# EAGLE design HoverPuck (EAGLE 7.2.0)
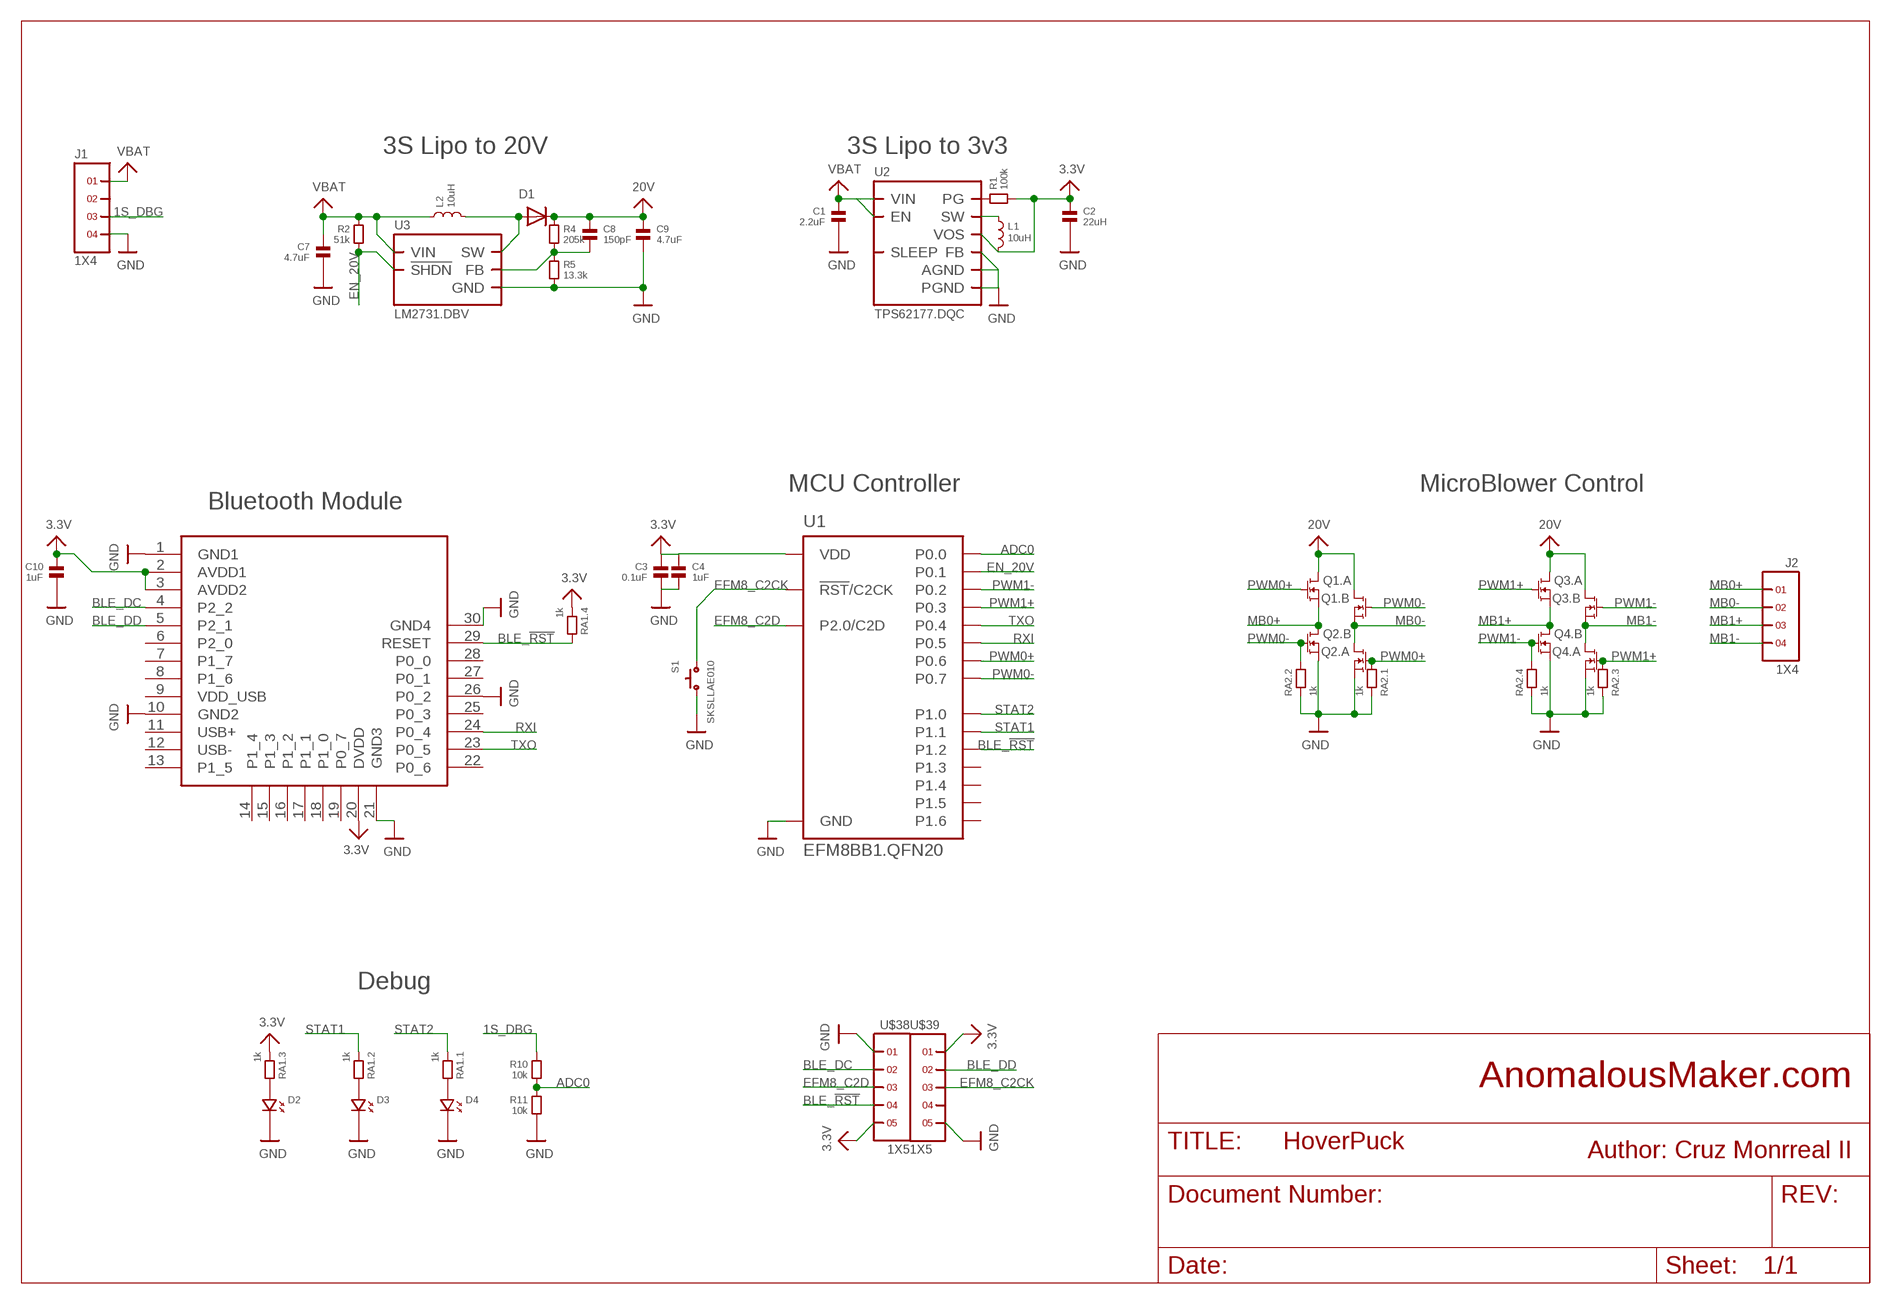
[diagram p0: schematic, sheet 1]

## Parts
C1  2.2uF  CAPACITOR.0603  [0603]
C2  22uH  CAPACITOR.0805  [0805]
C3  0.1uF  CAPACITOR.0603  [0603]
C4  1uF  CAPACITOR.0603  [0603]
C7  4.7uF  CAPACITOR.0805  [0805]
C8  150pF  CAPACITOR.0603  [0603]
C9  4.7uF  CAPACITOR.0805  [0805]
C10  1uF  CAPACITOR.0603  [0603]
D1  MBR0530T1G  DIODESOD-123  [SOD-123]
D2  LED.0603  [0603.LED]
D3  LED.0603  [0603.LED]
D4  LED.0603  [0603.LED]
J1  1X4  [1X4]
J2  1X4  [1X4]
L1  10uH  INDUCTOR.LPS4018  [LPS4018]
L2  10uH  INDUCTOR-SRN6045  [SRN6045]
Q1  FDMA  [MICROFET.2X2]
Q2  FDMA  [MICROFET.2X2]
Q3  FDMA  [MICROFET.2X2]
Q4  FDMA  [MICROFET.2X2]
R1  100k  RESISTOR.0603  [0603]
R2  51k  RESISTOR.0603  [0603]
R4  205k  RESISTOR.0603  [0603]
R5  13.3k  RESISTOR.0603  [0603]
R10  10k  RESISTOR.0603  [0603]
R11  10k  RESISTOR.0603  [0603]
RA1  1k  RA-4.0603  [0603.4.C]
RA2  1k  RA-4.0603  [0603.4.C]
S1  SKSLLAE010  [SKSLLAE010]
U1  EFM8BB1.QFN20  [QFN20]
U2  TPS62177.DQC  [DQC]
U3  LM2731.DBV  [DBV.5]
U4  BLE112-A  [BLE112-A]
U$38  1X5  [1X5]
U$39  1X5  [1X5]

## Nets
1S_DBG: J1.3 R10.1
3.3V: C2.1 C3.1 C4.1 C10.1 L1.2 R1.2 RA1.5 RA1.7 U1.4(VDD) U2.10(VOS) U4.2(AVDD1) U4.3(AVDD2) U4.20(DVDD) U$38.5 U$39.1
20V: C8.1 C9.1 D1.C Q1.3(.B:D) Q1.6(.A:D) Q1.PAD@1(.A:D) Q1.PAD@2(.B:D) Q3.3(.B:D) Q3.6(.A:D) Q3.PAD@1(.A:D) Q3.PAD@2(.B:D) R4.1
ADC0: R10.2 R11.1 U1.2(P0.0)
BLE_!RST: RA1.8 U1.11(P1.2) U4.29(RESET) U$38.4
BLE_DC: U4.4(P2_2) U$38.2
BLE_DD: U4.5(P2_1) U$39.2
EFM8_C2CK: S1.1 U1.5(!RST!/C2CK) U$39.3
EFM8_C2D: U1.6(P2.0/C2D) U$38.3
EN_20V: R2.2 U1.1(P0.1) U3.4(!SHDN)
GND: C1.2 C2.2 C3.2 C4.2 C7.2 C9.2 C10.2 D2.P$2 D3.P$2 D4.P$2 J1.4 Q2.1(.A:S) Q2.4(.B:S) Q4.1(.A:S) Q4.4(.B:S) R5.2 R11.2 RA2.1 RA2.3 RA2.5 RA2.7 S1.2 U1.3(GND) U1.12(GND) U1.PAD(GND) U2.1(PGND) U2.5(FB) U2.6(AGND) U2.PAD(PGND) U3.2(GND) U4.1(GND1) U4.10(GND2) U4.21(GND3) U4.26(P0_2) U4.30(GND4) U$38.1 U$39.5
MB0+: J2.1 Q1.1(.A:S) Q2.3(.B:D) Q2.PAD@2(.B:D)
MB0-: J2.2 Q1.4(.B:S) Q2.6(.A:D) Q2.PAD@1(.A:D)
MB1+: J2.3 Q3.1(.A:S) Q4.3(.B:D) Q4.PAD@2(.B:D)
MB1-: J2.4 Q3.4(.B:S) Q4.6(.A:D) Q4.PAD@1(.A:D)
N$3: L1.1 U2.9(SW)
N$4: D2.P$1 RA1.6
N$5: D1.A L2.2 U3.1(SW)
N$6: R1.1 U2.7(PG)
N$7: C8.2 R4.2 R5.1 U3.3(FB)
N$8: D3.P$1 RA1.4
N$9: D4.P$1 RA1.2
PWM0+: Q1.2(.A:G) Q2.2(.A:G) RA2.2 U1.16(P0.6)
PWM0-: Q1.5(.B:G) Q2.5(.B:G) RA2.4 U1.15(P0.7)
PWM1+: Q3.2(.A:G) Q4.2(.A:G) RA2.6 U1.19(P0.3)
PWM1-: Q3.5(.B:G) Q4.5(.B:G) RA2.8 U1.20(P0.2)
RXI: U1.17(P0.5) U4.24(P0_4)
STAT1: RA1.3 U1.13(P1.1)
STAT2: RA1.1 U1.14(P1.0)
TXO: U1.18(P0.4) U4.23(P0_5)
VBAT: C1.1 C7.1 J1.1 L2.1 R2.1 U2.2(VIN) U2.3(EN) U3.5(VIN)
Unconnected: J1.2 U1.7(P1.6) U1.8(P1.5) U1.9(P1.4) U1.10(P1.3) U2.8(SLEEP) U4.6(P2_0) U4.7(P1_7) U4.8(P1_6) U4.9(VDD_USB) U4.11(USB+) U4.12(USB-) U4.13(P1_5) U4.14(P1_4) U4.15(P1_3) U4.16(P1_2) U4.17(P1_1) U4.18(P1_0) U4.19(P0_7) U4.22(P0_6) U4.25(P0_3) U4.27(P0_1) U4.28(P0_0) U$39.4

## Notes on the sheet
- 3S Lipo to 20V | 3S Lipo to 3v3
- MCU Controller | MicroBlower Control
- Bluetooth Module
- Debug
- AnomalousMaker.com
- Author: Cruz Monrreal II

## Library data of the parts
C1-C4 C7-C10 = standardparts:CAPACITOR
D1 = microbuilder:DIODE: Diode SMA Model Volts Amps Type Vf Vr Digikey # Notes SSA34-E3 40V 3A Schottky 480mV @ 3A 200uA @ 40V SSA34-E3/61TGITR-ND CDBA120-G 20V 1A Schottky 500mV @ 1A 500uA @ 20V 641-1014-6-ND REEL MBRA210 10V 2A Schottky 350mV @ 2A 700uA @ 10V MBRA210LT3 SOD-123 Model Volts Amps Type Vf Vr Order # Notes BAT54T1G 30V 200mA Schottky 800mV @ 200mA 2uA @ 25V BAT54T1GOSTR-ND B0530W 30V 500mA Schottky 430mV @ 500mA 130uA @ 30V B0530W-FDICT-ND REEL MBR120 1A 20V Schottky 340mV @ 1A MBR120VLSFT1GOSCT-ND SOD-323 Model Volts Amps Type Vf Vr Order # Notes PMEG2005EJ 20V 500mA Schottky 355mV @ 500mA 568-4110-1-ND ZLLS410 10V 570mA Schottky 380mV @ 570mA ZLLS410CT-ND 1N4148WS 75V 150mA Silicon/Simple 1V 1N4148WSFSCT-ND REEL SOD-523 Model Volts Amps Type Vf Vr Order # Notes BAT54XV2 30V 200mA Schottky 0.8V @ 100mA BAT54XV2CT-ND TB751S 30V 30mA Schottky RB751S-40TE61CT-ND SOT23-R/W (R = Solder Paste/Reflow Ovens, W = Hand-Soldering) Model Volts Amps Type Vf Vr Order # Notes BAT54FILM 40V 300mA Schottky 497-7162-1-ND
D2-D4 = standardparts:LED
J1 J2 = headers(2mm):1X4
L1 = coilcraft:INDUCTOR
L2 = bourns:INDUCTOR
Q1-Q4 = fairchild:FDMA
R1 R2 R4 R5 R10 R11 = standardparts:RESISTOR
RA1 RA2 = resistorarray:RA-4: Dimentions sources from here: http://www.ctscorp.com/components/Datasheets/CTSChipArrayDs.pdf
S1 = alps:SKSLLAE010
U1 = silabs:EFM8BB1
U2 = packages(ti):TPS62177
U3 = packages(ti):LM2731
U4 = SparkFun-RF:BLE112-A: BlueGiga Bluetooth 4.0 module with integrated chip antenna and onboard 8051 processor and peripherals
U$38 U$39 = headers(.05in):1X5

## Board
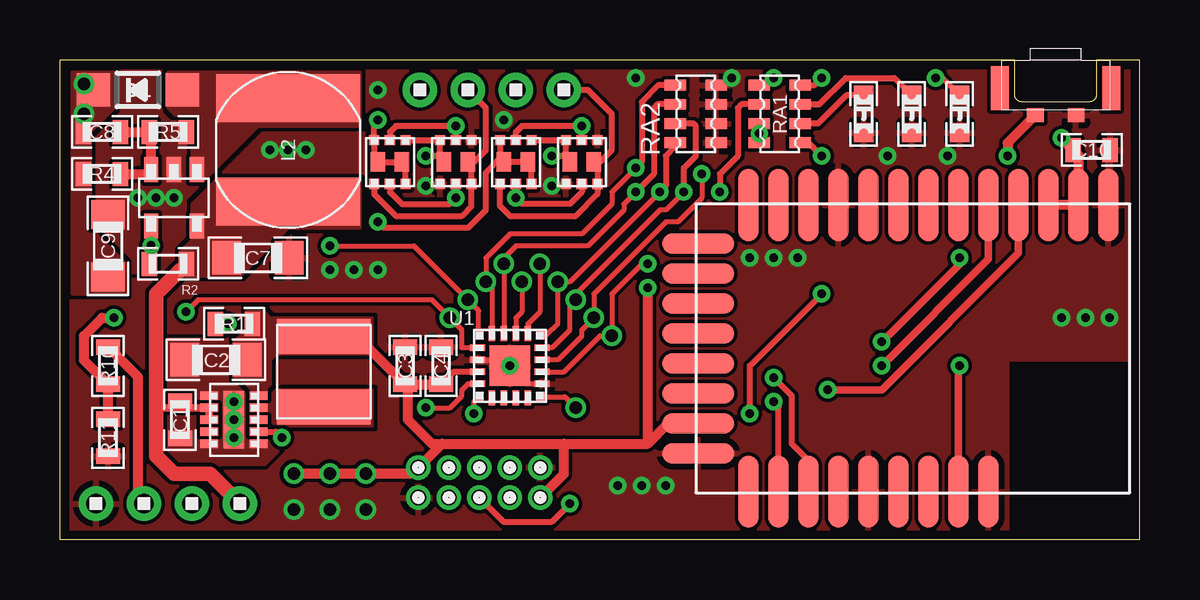
[diagram p1: board, top side]
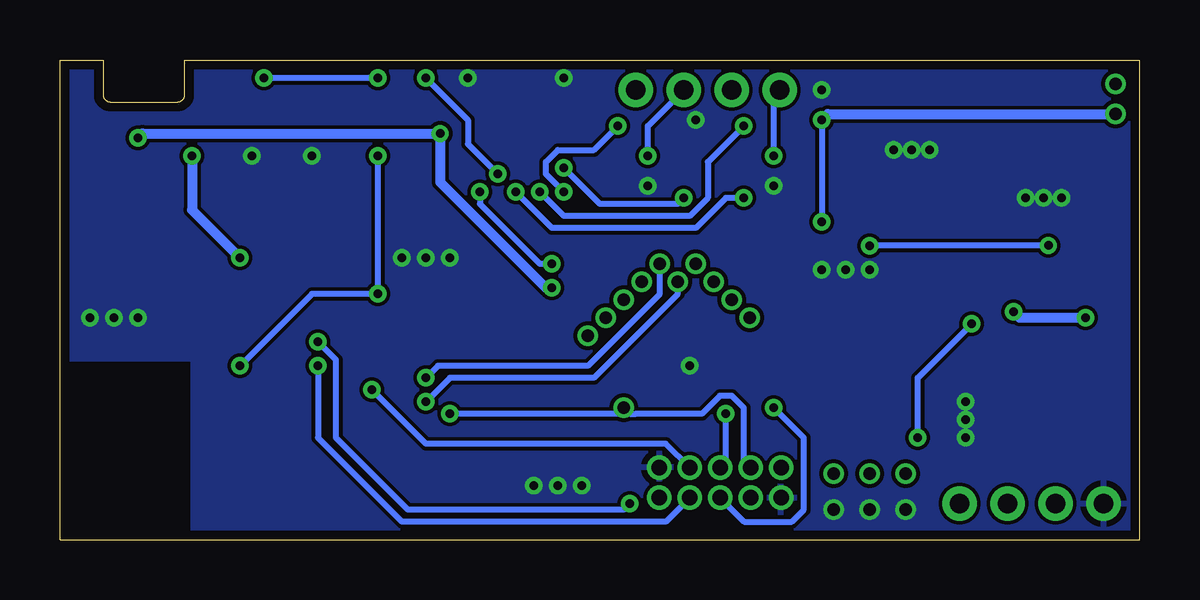
[diagram p2: board, bottom side, seen from below]

Size 45 x 20 mm. Coordinates in mm from the lower left corner, seen from the top.
Outline: 44.16,20 45,20 45,0 0,0 0,20 38.84,20
Copper layers (1*16): Top 0.0356mm / dielectric 1.5011mm / Bottom 0.0356mm
Design rules "OSHPark": minimum track width 6mil, minimum drill 13mil, track to track 6mil, track to pad 6mil, pad to pad 6mil, via to via 6mil, smd to smd 6mil, copper to edge 15mil, drill to drill 6mil, minimum pad ring 7mil, minimum via ring 7mil, stop-mask expansion 4mil, vias tented up to drill 16mil, thermal gap 10mil
tRestrict: 4 lines

### Footprints (pad centres in the part's own frame; a part is rotated, then mirrored left to right if it is on the bottom)
0603 = smd 0.65 x 1: 1 -0.775,0; 2 0.775,0
0805 = smd 1.2 x 1.4: 1 -1.3,0; 2 1.3,0
SOD-123 = smd 1.4 x 1.4: A 1.85,0; C -1.85,0
0603.LED = smd 0.8 x 0.8: P$1 -0.775,0; P$2 0.775,0
1X4 = drill 0.8 pad 1.422: 1 -3,0; 2 -1,0; 3 1,0; 4 3,0
LPS4018 = smd 1.45 x 3.9: 1 -1.47,0; 2 1.47,0
SRN6045 = smd 2 x 6: 1 -2.15,0; 2 2.15,0
MICROFET.2X2 = smd 0.42 x 0.42: 1 -0.65,-0.915; 2 0,-0.915; 3 0.65,-0.915; 4 0.65,0.915; 5 0,0.915; 6 -0.65,0.915 | smd 0.6 x 0.8: PAD@1 -0.5,0; PAD@2 0.5,0
0603.4.C = smd 0.45 x 0.9: 1 -1.2,-0.85; 2 -1.2,0.85; 3 -0.4,-0.85; 4 -0.4,0.85; 5 0.4,-0.85; 6 0.4,0.85; 7 1.2,-0.85; 8 1.2,0.85
SKSLLAE010 = smd 0.7 x 0.6: 1 -0.85,-2.3; 2 0.85,-2.3 | smd 0.75 x 1.85: A -2.325,-1.175; B 2.325,-1.175
QFN20 = smd 0.4 x 0.4: 1 -1.3,1.3; 6 -1.3,-1.3; 11 1.3,-1.3; 16 1.3,1.3 | smd 0.61 x 0.28: 2 -1.345,0.75; 3 -1.345,0.25; 4 -1.345,-0.25; 5 -1.345,-0.75; 12 1.345,-0.75; 13 1.345,-0.25; 14 1.345,0.25; 15 1.345,0.75 | smd 0.28 x 0.61: 7 -0.75,-1.345; 8 -0.25,-1.345; 9 0.25,-1.345; 10 0.75,-1.345; 17 0.75,1.345; 18 0.25,1.345; 19 -0.25,1.345; 20 -0.75,1.345 | smd 1.7 x 1.7: PAD 0,0
DQC = smd 0.75 x 0.37: 1 -1.025,1; 2 -1.025,0.5; 3 -1.025,0; 4 -1.025,-0.5; 5 -1.025,-1; 6 1.025,-1; 7 1.025,-0.5; 8 1.025,0; 9 1.025,0.5; 10 1.025,1 | smd 0.84 x 2.4: PAD 0,0
DBV.5 = smd 1.05 x 0.6: 1 -1.175,0.95; 2 -1.175,0; 3 -1.175,-0.95; 4 1.175,-0.95; 5 1.175,0.95
BLE112-A = smd 3 x 0.85: 1 0.05,17.2; 2 0.05,15.95; 3 0.05,14.7; 4 0.05,13.45; 5 0.05,12.2; 6 0.05,10.95; 7 0.05,9.7; 8 0.05,8.45; 9 0.05,7.2; 10 0.05,5.95; 11 0.05,4.7; 12 0.05,3.45; 13 0.05,2.2; 22 12,2.2; 23 12,3.45; 24 12,4.7; 25 12,5.95; 26 12,7.2; 27 12,8.45; 28 12,9.7; 29 12,10.95; 30 12,12.2 | smd 0.85 x 3: 14 1.65,0.1; 15 2.9,0.1; 16 4.15,0.1; 17 5.4,0.1; 18 6.65,0.1; 19 7.9,0.1; 20 9.15,0.1; 21 10.4,0.1
1X5 = drill 0.635 pad 1.016: 1 0,0; 2 1.27,0; 3 2.54,0; 4 3.81,0; 5 5.08,0

### Placement (x,y rotation side)
C1  5,5 270 top
C2  6.5,7.5 180 top
C3  14.38,7.25 90 top
C4  15.88,7.25 90 top
C7  8.25,11.75 0 top
C8  1.75,17 0 top
C9  2,12.25 90 top
C10  43,16.25 0 top
D1  3.25,18.75 0 top
D2  33.5,17.75 270 top
D3  35.5,17.75 270 top
D4  37.5,17.75 270 top
J1  4.5,1.5 180 top
J2  18,18.75 0 top
L1  11,7 90 top
L2  9.5,16.25 90 top
Q1  13.75,15.75 180 top
Q2  16.5,15.75 180 top
Q3  19,15.75 180 top
Q4  21.75,15.75 180 top
R1  7.25,9 0 top
R2  4.5,11.5 180 top
R4  1.75,15.25 0 top
R5  4.5,17 0 top
R10  2,7.25 270 top
R11  2,4.25 270 top
RA1  30,17.75 270 top
RA2  26.5,17.75 90 top
S1  41.5,20 0 top
U1  18.75,7.25 0 top
U2  7.25,5 0 top
U3  4.75,14.25 270 top
U4  26.5,14 270 top
U$38  20.02,3 180 top
U$39  20.02,1.75 180 top

### Tracks (layer width: path | path; a pad name or v marks a point on that pad's centre or on a via)
1S_DBG
  Top 0.406: J1.3 3.25,1.75 3.25,6.78 R10.1
3.3V  (via drill 0.36, 0.51)
  Top 0.254: RA1.5 v29.15,16.93 RA1.7 | U1.4 16.41,7 C4.1
  Top 0.406: U4.3 U4.2 42.45,16.02 C10.1 41.75,16.73 v41.75,16.75 | C3.1 C4.1 | U4.20 25.35,4.85 24.5,4 | C3.1 12.39,8.47 L1.2 | 15.94,4 15.5,4 14.5,5 14.5,6.36 C3.1 | 15.94,4 21,4 | 21,4 24.5,4 | 15.94,4 U$38.5 14.69,2.75 v12.75,2.75 v11.25,2.75 v9.75,2.75 | U$39.1 21,2.73 21,4 | 24.5,4 v24.5,10.5 | 12.75,8.75 11,8.75
  Bottom 0.406: v41.75,16.75 41.56,16.93 v29.15,16.93 29.15,14.9 24.75,10.5 v24.5,10.5
  pour Top (rank 2, no thermals): 7.75,9.5 8.5,9.5 8.75,9.25 13,9.25 13,7.75 9,7.75 8.75,7.5 8.75,5.75 8,5.75 8,6.25 7.5,6.75 7.25,6.75 7.25,8.25 7.75,8.75
20V  (via drill 0.36, 0.51)
  Top 0.254: Q1.6 14.4,15.6 Q1.PAD@1 Q1.PAD@2 13.1,15.9 Q1.3 13.1,17.35 v13.25,17.5 | Q3.3 18.35,15.9 | 18.35,15.9 Q3.PAD@2 Q3.PAD@1 19.65,15.6 Q3.6 | 18.35,15.9 17.75,15.3 17.75,13.75 17,13 13.5,13 v13.25,13.25
  Top 0.406: v1,17.75 1,17.02 C8.1
  Bottom 0.254: v13.25,17.5 v13.25,13.25
  Bottom 0.406: v13.25,17.5 13,17.75 v1,17.75
  other vias: 1,19
  pour Top (rank 2, no thermals): 2.25,19.5 0.5,19.5 0.5,10.25 2.75,10.25 2.75,11.5 1.25,13 1.25,17 2.25,18
ADC0  (via drill 0.36, 0.51)
  Top 0.203: v5.25,9.5 5.75,10 15.5,10 v16.25,9.25 16.75,8.75 16.75,8 U1.2
  Top 0.406: R11.1 R10.2 1,7.47 1,8.5 1.75,9.25 v2.25,9.25
  Bottom 0.406: v2.25,9.25 5,9.25 v5.25,9.5
BLE_!RST  (via drill 0.36, 0.51)
  Top 0.203: U1.11 21.05,5.95 v21.5,5.5
  Top 0.254: RA1.8 31.2,16.55 v31.75,16 | v28.75,5.25 28.75,7.25 v31.75,10.25
  Top 0.305: U4.29 37.45,7.2 v37.5,7.25
  Bottom 0.254: U$38.4 16.5,3.29 16.5,5.5 17,6 17.5,6 18.25,5.25 21,5.25 21.25,5.25 | 21.25,5.25 v28.75,5.25 | v31.75,16 v31.75,10.25 34.5,10.25 v37.5,7.25 | v21.5,5.5 21.25,5.25
BLE_DC  (via drill 0.36)
  Top 0.305: U4.4 39.95,11.95 34.25,6.25 v32,6.25
  Bottom 0.254: U$38.2 19.75,4 29.75,4 v32,6.25
BLE_DD  (via drill 0.36)
  Top 0.305: U4.5 38.7,11.7 v34.25,7.25
  Bottom 0.254: U$39.2 19.75,0.75 30.75,0.75 34.25,4.25 v34.25,7.25
EFM8_C2CK  (via drill 0.36)
  Top 0.203: v15.25,5.5 16.25,5.5 16.75,6 16.75,6.25 17,6.5 U1.5
  Top 0.254: U$39.3 18.48,0.75 20.5,0.75 v21.25,1.5
  Top 0.305: v34.25,8.25 37.5,11.5 v37.5,11.75
  Top 0.406: S1.1 39.5,16.55 v39.5,16
  Bottom 0.254: U$39.3 16.48,0.75 14.5,0.75 14,1.25 14,4.25 v15.25,5.5 | v21.25,1.5 21.5,1.25 30.5,1.25 33.5,4.25 33.5,7.5 v34.25,8.25
  Bottom 0.406: v39.5,16 39.5,13.75 v37.5,11.75
EFM8_C2D  (via drill 0.36)
  Top 0.203: 17.48,5.92 U1.6 17.25,5.75 v17.25,5.25
  Bottom 0.254: U$38.3 17.25,3.23 v17.25,5.25
EN_20V  (via drill 0.36, 0.51)
  Top 0.203: v11.25,12.25 14.75,12.25 v17,10 17.45,9.55 U1.1
  Top 0.406: U3.4 v3.8,12.26 3.8,11.57 R2.2
  Bottom 0.254: v3.8,12.26 11.24,12.26 v11.25,12.25
GND  (via drill 0.36, 0.51)
  Top 0.203: U1.12 19.5,6.5 U1.PAD
  Top 0.254: U1.3 18.5,7.5 U1.PAD
  other vias: 20.5,14.75 15.25,14.75 18.5,17.5 13.25,18.75 9.5,16.25 4.75,14.25 4,14.25 3.25,14.25 8.75,16.25 10.25,16.25 7.25,5 7.25,5.75 7.25,4.25 28,19.25 24,19.25 11.25,11.25 12.25,11.25 13.25,11.25 18.75,7.25 43.75,9.25 42.75,9.25 41.75,9.25 28.75,11.75 29.75,11.75 30.75,11.75 34.5,16 37,16 23.25,2.25 24.25,2.25 25.25,2.25 9.75,1.25 11.25,1.25 12.75,1.25
  pour Top (rank 6): 0,0 39.5,0 39.5,7.5 45,7.5 45,20 0,20
  pour Bottom (rank 6): 0,20 45,20 45,7.5 39.5,7.5 39.5,0 0,0
  pour Top (rank 3, no thermals): 0.5,19.5 6,19.5 6,11 0.5,11
  pour Top (rank 3, no thermals): 4.5,8.5 8.5,8.5 8.5,4.75 9.25,4 9.25,3.75 8.5,3 5,3 4.25,3.75 4.25,8.5
MB0+  (via drill 0.36)
  Top 0.254: Q1.1 Q2.3 15.85,15.9 | Q2.PAD@2 15.85,15.9 | 15.85,15.9 15.75,16 v15.25,16
  Bottom 0.254: v15.25,16 15.25,18.5 J2.1
MB0-
  Top 0.254: J2.2 17.75,18 17.75,16.25 17.25,15.75 Q2.PAD@1 17.15,15.6 Q2.6 17.15,13.9 16.75,13.5 14,13.5 13.1,14.4 Q1.4
MB1+  (via drill 0.36)
  Top 0.254: Q3.1 Q4.3 21.1,15.9 Q4.PAD@2 21,16 v20.5,16
  Bottom 0.254: v20.5,16 20.5,17.25 J2.3
MB1-
  Top 0.254: Q3.4 18.35,13.9 18.75,13.5 21.5,13.5 22.4,14.4 Q4.6 22.4,15.6 Q4.PAD@1 22.5,15.75 23,16.25 23,17.75 22,18.75 J2.4
N$3
  pour Top (no thermals): 9,6.25 13,6.25 13,4.75 9,4.75 8.5,5.25 8,5.25 8,5.75 8.5,5.75
N$4
  Top 0.254: D2.P$1 32.77,18.52 31.6,17.35 RA1.6
N$5
  pour Top (rank 2, no thermals): 12.5,19.5 4.5,19.5 4.5,18 5.5,17 5.5,15 6,15 8.25,17.25 12.5,17.25
N$6  (via drill 0.36)
  Top 0.254: U2.7 9,4.5 v9.25,4.25 | v7,9 R1.1
  Bottom 0.254: v9.25,4.25 9.25,6.75 v7,9
N$7
  Top 0.406: C8.2 R5.1 3.8,16.93 U3.3 3.62,15.25 R4.2
N$8
  Top 0.254: RA1.4 31.65,18.15 32.75,19.25 34.77,19.25 D3.P$1
N$9  (via drill 0.36)
  Top 0.254: RA1.2 31.45,18.95 v31.75,19.25 | v36.5,19.25 36.77,19.25 D4.P$1
  Bottom 0.254: v31.75,19.25 v36.5,19.25
PWM0+  (via drill 0.36, 0.51)
  Top 0.203: U1.16 20.3,8.55 20.75,9 v20.75,10.75 21.25,10.75 v25,14.5
  Top 0.254: Q2.2 16.5,17 16.25,17.25 | Q1.2 13.75,17 14,17.25 16.25,17.25 | 16.25,17.25 v16.5,17.25 | RA2.2 25.65,16.4 25.25,16 25.25,14.75 v25,14.5
  Bottom 0.254: v16.5,17.25 18,15.75 18,14.25 18.75,13.5 24,13.5 v25,14.5
PWM0-  (via drill 0.36, 0.51)
  Top 0.203: v26,14.5 25.25,13.75 25,13.75 21.5,10.25 v21.5,10 21.25,9.75 21.25,8.75 20.5,8 U1.15
  Top 0.254: Q1.5 13.75,14.5 14.25,14 16.25,14 v16.5,14.25 Q2.5 16.5,14.5 | v26,14.5 26,15.5 26.5,16 26.5,17.25 26.4,17.35 RA2.4
  Bottom 0.254: v16.5,14.25 17.25,14.25 18.5,13 24.5,13 v26,14.5
PWM1+  (via drill 0.36, 0.51)
  Top 0.203: v24,14.5 23.5,14 23.5,13.75 22,12.25 19,12.25 18.5,11.75 v18.5,11.5 U1.19
  Top 0.254: Q3.2 19,17 19.25,17.25 21.5,17.25 | Q4.2 21.75,17 21.5,17.25 | RA2.6 24.9,18.15 24.75,18 24.75,15.25 v24,14.5 | 21.5,17.25 v21.75,17.25
  Bottom 0.254: v24,14.5 24.75,15.25 24.75,15.75 24.25,16.25 22.75,16.25 v21.75,17.25
PWM1-  (via drill 0.36, 0.51)
  Top 0.203: v24,15.5 23,14.5 23,14 21.75,12.75 18.75,12.75 17.75,11.75 v17.75,10.75 18,10.5 U1.20
  Top 0.254: 19,14.5 Q3.5 v19,14.25 19.25,14 21.25,14 21.75,14.5 Q4.5 | RA2.8 24.95,18.95 24.25,18.25 24.25,15.75 v24,15.5
  Bottom 0.254: v19,14.25 19.25,14 22.5,14 v24,15.5
RXI  (via drill 0.36, 0.51)
  Top 0.203: v20,11.5 20,9.5 19.5,9 U1.17
  Top 0.254: U4.24 31.2,3.3 30.5,4 30.5,6 v29.75,6.75
  Bottom 0.254: v29.75,6.75 29.25,7.25 23,7.25 20,10.25 v20,11.5
STAT1  (via drill 0.36, 0.51)
  Top 0.203: U1.13 21,7 22.5,8.5 v23,8.5 23,10.25 24.25,11.5 v24.5,11.5
  Top 0.254: v27.5,14.5 27.5,15.25 28.25,16 28.25,18 28.4,18.15 RA1.3
  Bottom 0.254: v27.5,14.5 27.5,14 25,11.5 v24.5,11.5
STAT2  (via drill 0.36, 0.51)
  Top 0.203: v26.75,15.25 26.75,14.25 25.75,13.25 25.25,13.25 22.25,10.25 v22.25,9.25 21.75,8.75 21.75,8.5 20.75,7.5 U1.14
  Top 0.254: RA1.1 29.45,18.95 v29.75,19.25
  Bottom 0.254: v29.75,19.25 28,17.5 28,16.5 v26.75,15.25
TXO  (via drill 0.36, 0.51)
  Top 0.203: v19.25,10.75 19.25,9.5 19,9.25 U1.18
  Top 0.254: U4.23 29.95,5.55 v29.75,5.75
  Bottom 0.254: v29.75,5.75 28.75,6.75 22.75,6.75 19.25,10.25 v19.25,10.75
VBAT
  Top 0.305: U2.3 U2.2 5.28,5.5 | 5.28,5.5 C1.1 | 5.28,5.5 4,5.5
  Top 0.406: 5,11.25 5,11.22 R2.1
  Top 0.61: J1.1 6.25,2.75 4.75,2.75 4,3.5 4,5.5 4,10.25 5,11.25
  pour Top (no thermals): 12.5,15 6.5,15 5.5,14 5.5,12.5 5,12 5,11 7.5,11 9.5,13 12.5,13

### Text on the board
bDocu: 20V | PWM1+ | RXI | PWM1- | PWM0+ | EN_20V | TXO | PWM0- | STAT2 | VBAT (1S)/2 | STAT1 | BLE_!RST | 3.3V | HoverPuck | Cruz Monrreal II / AnomalousMaker.com